# Altium schematic sheet SWITCH.SchDoc
size A4; SheetNumber: 3; SheetTotal: 3; SPICEModelCacheBBBPLXQV: <root> / <DocumentId>BBBPLXQV</DocumentId> / <CacheFrame Number="0"> / <Model Name="led0" Kind="MDL"> / <Text>*Typ INFRARED GaAs LED: Vf=1.2V Vr=5V If=40mA trr=3uS / *LED Pinout: 1=A, 2=K / .MODEL LED0 D (IS=93.5P RS=84M N=2.63 BV=5 IBV=10U / + CJO=2.97P VJ=.75 M=.333 TT=4.32U)</Text> / </Model> / </CacheFrame> / </root>
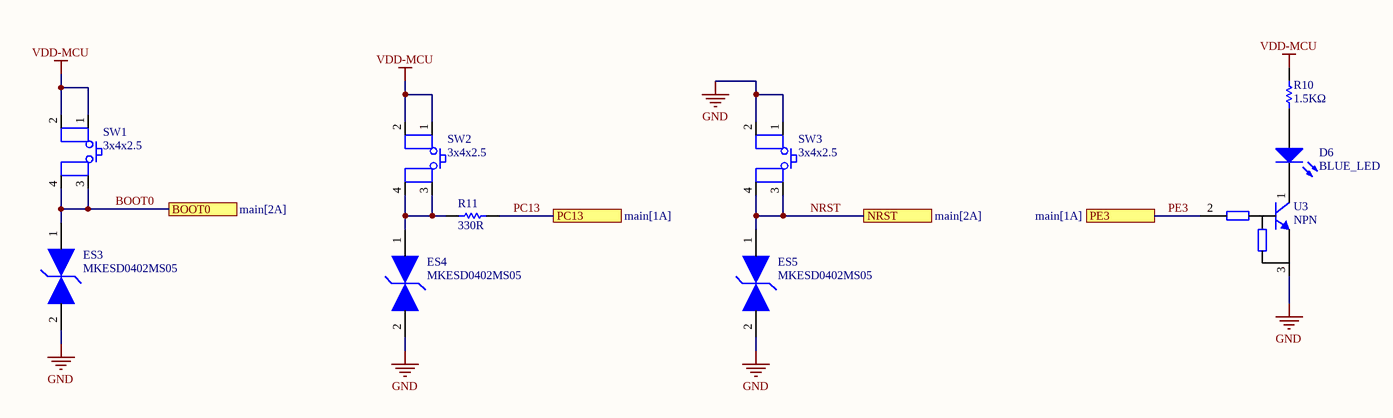
[diagram p0: SWITCH.SchDoc]

## Parts
D6  BLUE_LED  [0603_LED_BLUE]
ES3  MKESD0402MS05  [MKESD0402MS05]
ES4  MKESD0402MS05  [MKESD0402MS05]
ES5  MKESD0402MS05  [MKESD0402MS05]
R10  value 1.5KΩ  [0402_Resistor]  (hidden comment: Res1)
R11  value 330R  [0402_Resistor]  (hidden comment: Res1)
SW1  3x4x2.5  [TACT_switch]
SW2  3x4x2.5  [TACT_switch]
SW3  3x4x2.5  [TACT_switch]
U3  NPN  [SOT23_3L]

## Ports
BOOT0 (see main[2A]), NRST (see main[2A]), PC13 (see main[1A]), PE3 (see main[1A])

## Nets
GND: ES3.2 ES4.2 ES5.2 SW3.1 SW3.2 U3.3
VDD-MCU: R10.1 SW1.1 SW1.2 SW2.1 SW2.2
BOOT0: ES3.1 SW1.3 SW1.4 ; port BOOT0
NRST: ES5.1 SW3.3 SW3.4 ; port NRST
PC13: R11.1 ; port PC13
PE3: U3.2 ; port PE3
NetD6_1: D6.1(A) R10.2
NetD6_2: D6.2(K) U3.1(I)
NetES4_1: ES4.1 R11.2 SW2.3 SW2.4

## Library data of the parts
D6 = LED0: Typical INFRARED GaAs LED; Published: 8-Jun-2000; LatestRevisionDate: 08-Jul-2005; LatestRevisionNote: Mech Layer 1 removed.; PackageReference: LED-0; Publisher: Altium Limited; PackageDescription: LED; 2 Leads
ES3-ES5 = ESD1
R10 R11 = Res1: Resistor; Published: 8-Jun-2000; LatestRevisionDate: 17-Jul-2002; LatestRevisionNote: Re-released for DXP Platform.; PackageReference: AXIAL-0.3; Publisher: Altium Limited; PackageDescription: Axial Device, Thru-Hole; 2 Leads; 0.3 in Pin Spacing
SW1-SW3 = SW1
U3 = NPN_REC2